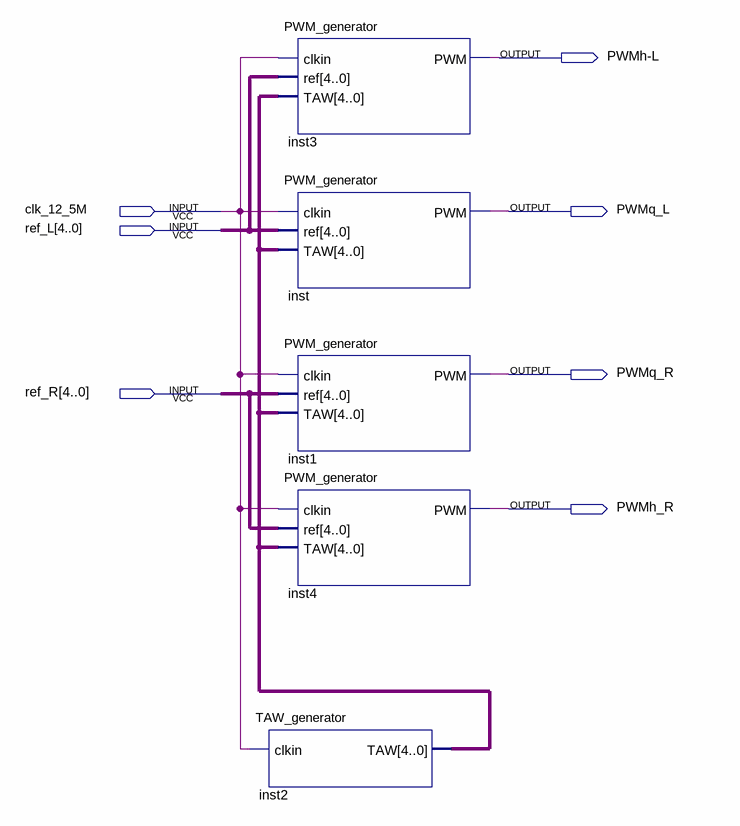
[diagram p0: schematic sheet]
// Quartus schematic pwm.bdf as structural Verilog: 5 symbols, 7 pins
module pwm (
  input  clk_12_5M,
  input  [4:0] ref_L,
  input  [4:0] ref_R,
  output \PWMh-L ,
  output PWMq_L,
  output PWMq_R,
  output PWMh_R
);

  wire [4:0] inst2_taw;

  PWM_generator inst3 (.clkin(clk_12_5M), .\ref (ref_L), .TAW(inst2_taw), .PWM(\PWMh-L ));
  PWM_generator inst (.clkin(clk_12_5M), .\ref (ref_L), .TAW(inst2_taw), .PWM(PWMq_L));
  PWM_generator inst1 (.clkin(clk_12_5M), .\ref (ref_R), .TAW(inst2_taw), .PWM(PWMq_R));
  PWM_generator inst4 (.clkin(clk_12_5M), .\ref (ref_R), .TAW(inst2_taw), .PWM(PWMh_R));
  TAW_generator inst2 (.clkin(clk_12_5M), .TAW(inst2_taw));
endmodule
